# EAGLE schematic FPGA_pin_demo (EAGLE 5.10)

## Sheet 1 of 5
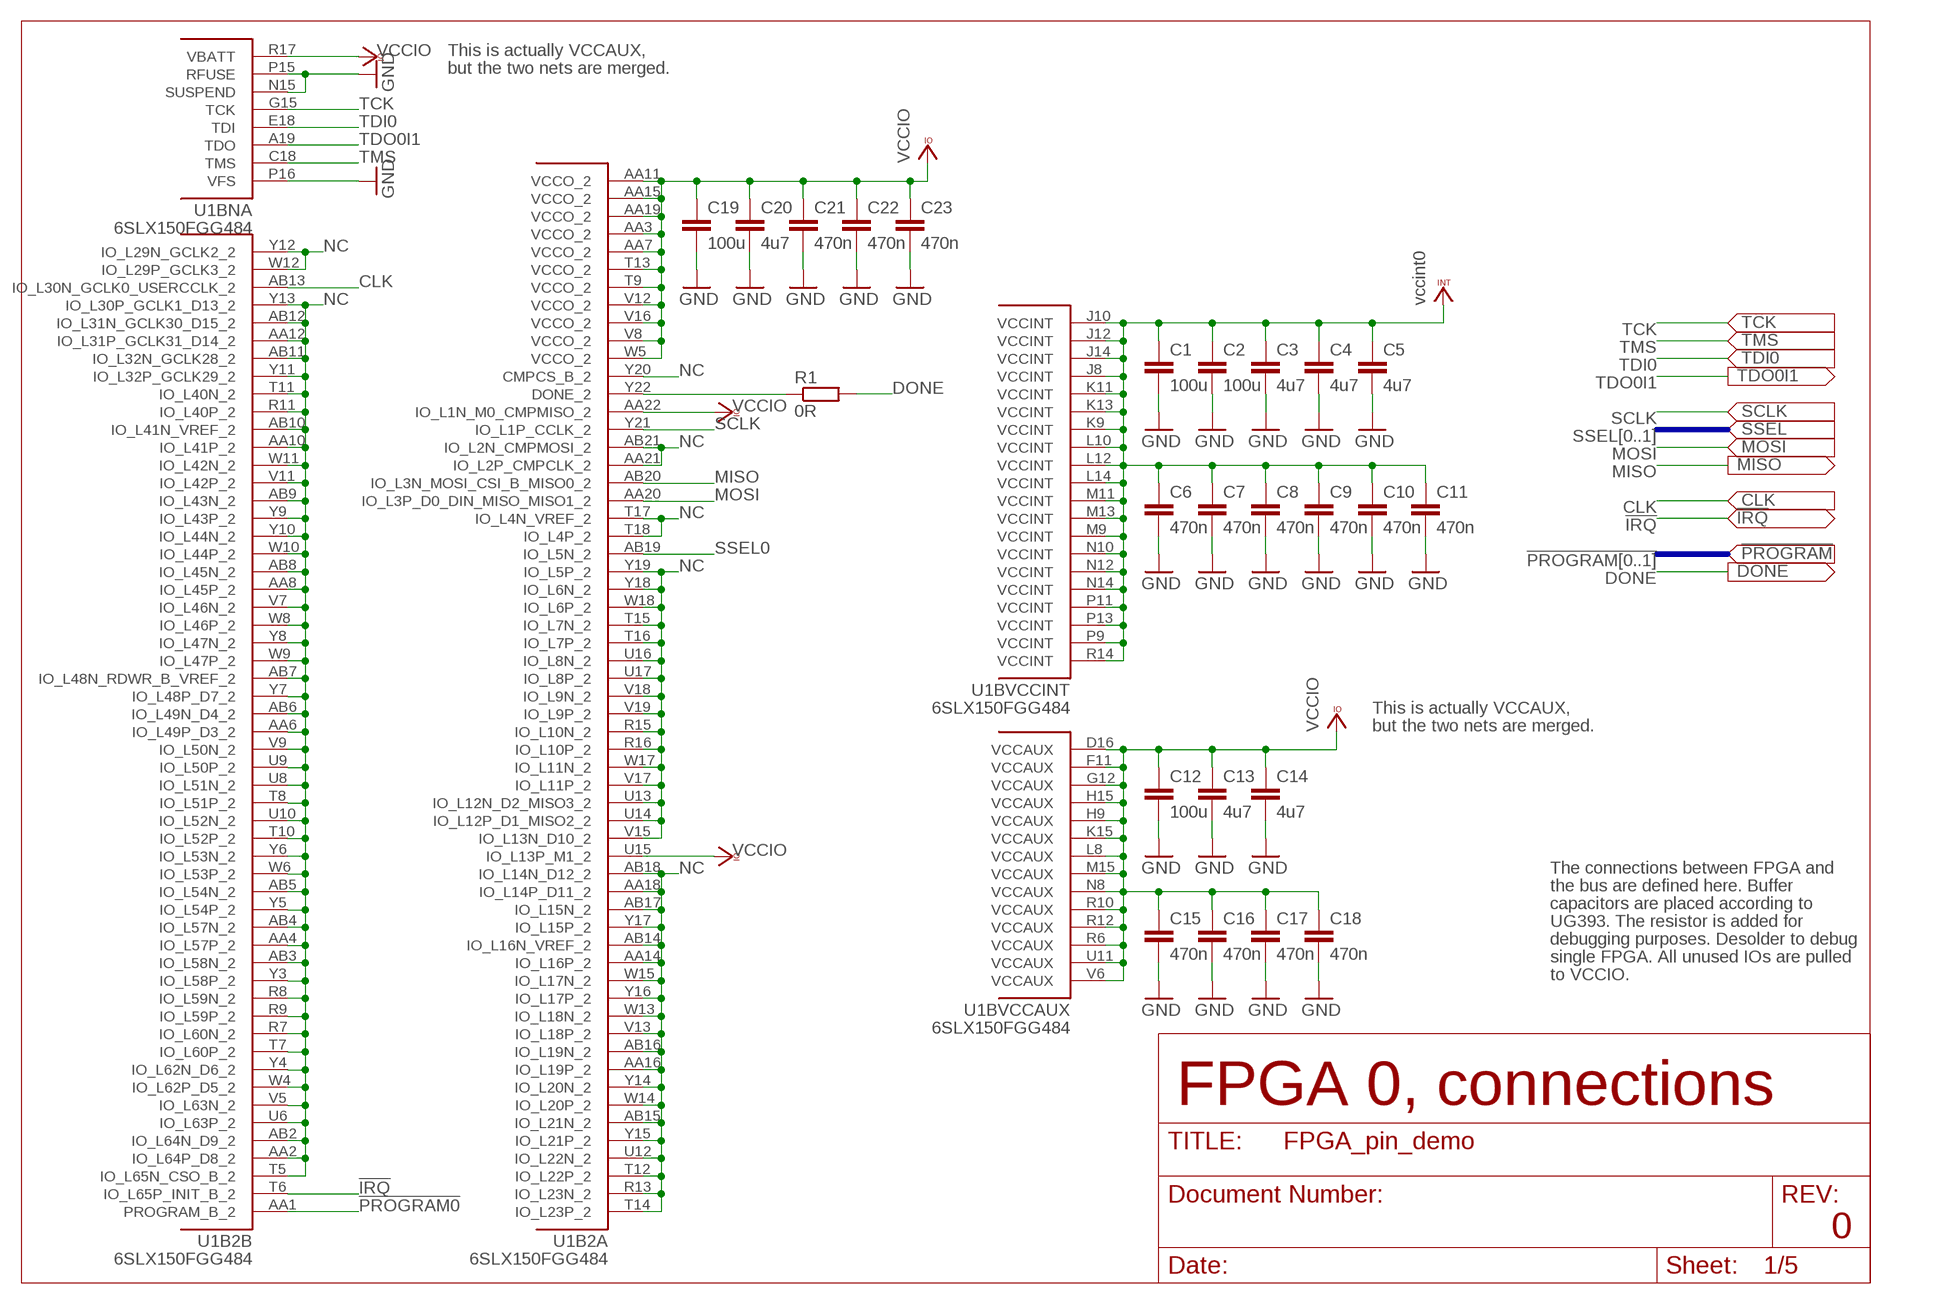
[diagram p0: schematic, sheet 1]

### Parts
C1  100u  C-EUC3225  [C3225]
C2  100u  C-EUC3225  [C3225]
C3  4u7  C-EUC2012  [C2012]
C4  4u7  C-EUC2012  [C2012]
C5  4u7  C-EUC2012  [C2012]
C6  470n  C-EUC1005  [C1005]
C7  470n  C-EUC1005  [C1005]
C8  470n  C-EUC1005  [C1005]
C9  470n  C-EUC1005  [C1005]
C10  470n  C-EUC1005  [C1005]
C11  470n  C-EUC1005  [C1005]
C12  100u  C-EUC3225  [C3225]
C13  4u7  C-EUC2012  [C2012]
C14  4u7  C-EUC2012  [C2012]
C15  470n  C-EUC1005  [C1005]
C16  470n  C-EUC1005  [C1005]
C17  470n  C-EUC1005  [C1005]
C18  470n  C-EUC1005  [C1005]
C19  100u  C-EUC3225  [C3225]
C20  4u7  C-EUC2012  [C2012]
C21  470n  C-EUC1005  [C1005]
C22  470n  C-EUC1005  [C1005]
C23  470n  C-EUC1005  [C1005]
R1  0R  R-EU_R2012  [R2012]
U1  6SLX150FGG484  [FG484]

### Nets
!IRQ: U1.T6(B2B:IO_L65P_INIT_B_2) ; also sheet 3,5
!PROGRAM0: U1.AA1(B2B:PROGRAM_B_2) ; also sheet 5
CLK: U1.AB13(B2B:IO_L30N_GCLK0_USERCCLK_2) ; also sheet 3,5
DONE: R1.2 ; also sheet 3,5
DONE_0: R1.1 U1.Y22(B2A:DONE_2)
GND: C1.2 C2.2 C3.2 C4.2 C5.2 C6.2 C7.2 C8.2 C9.2 C10.2 C11.2 C12.2 C13.2 C14.2 C15.2 C16.2 C17.2 C18.2 C19.2 C20.2 C21.2 C22.2 C23.2 U1.N15(BNA:SUSPEND) U1.P15(BNA:RFUSE) U1.P16(BNA:VFS) ; also sheet 2,3,4,5
MISO: U1.AB20(B2A:IO_L3N_MOSI_CSI_B_MISO0_2) ; also sheet 3,5
MOSI: U1.AA20(B2A:IO_L3P_D0_DIN_MISO_MISO1_2) ; also sheet 3,5
NC: U1.AA2(B2B:IO_L64P_D8_2) U1.AA4(B2B:IO_L57P_2) U1.AA6(B2B:IO_L49P_D3_2) U1.AA8(B2B:IO_L45P_2) U1.AA10(B2B:IO_L41P_2) U1.AA12(B2B:IO_L31P_GCLK31_D14_2) U1.AA14(B2A:IO_L16P_2) U1.AA16(B2A:IO_L19P_2) U1.AA18(B2A:IO_L14P_D11_2) U1.AA21(B2A:IO_L2P_CMPCLK_2) U1.AB2(B2B:IO_L64N_D9_2) U1.AB3(B2B:IO_L58N_2) U1.AB4(B2B:IO_L57N_2) U1.AB5(B2B:IO_L54N_2) U1.AB6(B2B:IO_L49N_D4_2) U1.AB7(B2B:IO_L48N_RDWR_B_VREF_2) U1.AB8(B2B:IO_L45N_2) U1.AB9(B2B:IO_L43N_2) U1.AB10(B2B:IO_L41N_VREF_2) U1.AB11(B2B:IO_L32N_GCLK28_2) U1.AB12(B2B:IO_L31N_GCLK30_D15_2) U1.AB14(B2A:IO_L16N_VREF_2) U1.AB15(B2A:IO_L21N_2) U1.AB16(B2A:IO_L19N_2) U1.AB17(B2A:IO_L15N_2) U1.AB18(B2A:IO_L14N_D12_2) U1.AB21(B2A:IO_L2N_CMPMOSI_2) U1.R7(B2B:IO_L60N_2) U1.R8(B2B:IO_L59N_2) U1.R9(B2B:IO_L59P_2) U1.R11(B2B:IO_L40P_2) U1.R13(B2A:IO_L23N_2) U1.R15(B2A:IO_L10N_2) U1.R16(B2A:IO_L10P_2) U1.T5(B2B:IO_L65N_CSO_B_2) U1.T7(B2B:IO_L60P_2) U1.T8(B2B:IO_L51P_2) U1.T10(B2B:IO_L52P_2) U1.T11(B2B:IO_L40N_2) U1.T12(B2A:IO_L22P_2) U1.T14(B2A:IO_L23P_2) U1.T15(B2A:IO_L7N_2) U1.T16(B2A:IO_L7P_2) U1.T17(B2A:IO_L4N_VREF_2) U1.T18(B2A:IO_L4P_2) U1.U6(B2B:IO_L63P_2) U1.U8(B2B:IO_L51N_2) U1.U9(B2B:IO_L50P_2) U1.U10(B2B:IO_L52N_2) U1.U12(B2A:IO_L22N_2) U1.U13(B2A:IO_L12N_D2_MISO3_2) U1.U14(B2A:IO_L12P_D1_MISO2_2) U1.U16(B2A:IO_L8N_2) U1.U17(B2A:IO_L8P_2) U1.V5(B2B:IO_L63N_2) U1.V7(B2B:IO_L46N_2) U1.V9(B2B:IO_L50N_2) U1.V11(B2B:IO_L42P_2) U1.V13(B2A:IO_L18P_2) U1.V15(B2A:IO_L13N_D10_2) U1.V17(B2A:IO_L11P_2) U1.V18(B2A:IO_L9N_2) U1.V19(B2A:IO_L9P_2) U1.W4(B2B:IO_L62P_D5_2) U1.W6(B2B:IO_L53P_2) U1.W8(B2B:IO_L46P_2) U1.W9(B2B:IO_L47P_2) U1.W10(B2B:IO_L44P_2) U1.W11(B2B:IO_L42N_2) U1.W12(B2B:IO_L29P_GCLK3_2) U1.W13(B2A:IO_L18N_2) U1.W14(B2A:IO_L20P_2) U1.W15(B2A:IO_L17N_2) U1.W17(B2A:IO_L11N_2) U1.W18(B2A:IO_L6P_2) U1.Y3(B2B:IO_L58P_2) U1.Y4(B2B:IO_L62N_D6_2) U1.Y5(B2B:IO_L54P_2) U1.Y6(B2B:IO_L53N_2) U1.Y7(B2B:IO_L48P_D7_2) U1.Y8(B2B:IO_L47N_2) U1.Y9(B2B:IO_L43P_2) U1.Y10(B2B:IO_L44N_2) U1.Y11(B2B:IO_L32P_GCLK29_2) U1.Y12(B2B:IO_L29N_GCLK2_2) U1.Y13(B2B:IO_L30P_GCLK1_D13_2) U1.Y14(B2A:IO_L20N_2) U1.Y15(B2A:IO_L21P_2) U1.Y16(B2A:IO_L17P_2) U1.Y17(B2A:IO_L15P_2) U1.Y18(B2A:IO_L6N_2) U1.Y19(B2A:IO_L5P_2) U1.Y20(B2A:CMPCS_B_2) ; also sheet 2,3,4,5
SCLK: U1.Y21(B2A:IO_L1P_CCLK_2) ; also sheet 3,5
SSEL0: U1.AB19(B2A:IO_L5N_2) ; also sheet 5
TCK: U1.G15(BNA:TCK) ; also sheet 3,5
TDI0: U1.E18(BNA:TDI) ; also sheet 5
TDO0I1: U1.A19(BNA:TDO) ; also sheet 3
TMS: U1.C18(BNA:TMS) ; also sheet 3,5
VCCINT0: C1.1 C2.1 C3.1 C4.1 C5.1 C6.1 C7.1 C8.1 C9.1 C10.1 C11.1 U1.J8(BVCCINT:VCCINT) U1.J10(BVCCINT:VCCINT) U1.J12(BVCCINT:VCCINT) U1.J14(BVCCINT:VCCINT) U1.K9(BVCCINT:VCCINT) U1.K11(BVCCINT:VCCINT) U1.K13(BVCCINT:VCCINT) U1.L10(BVCCINT:VCCINT) U1.L12(BVCCINT:VCCINT) U1.L14(BVCCINT:VCCINT) U1.M9(BVCCINT:VCCINT) U1.M11(BVCCINT:VCCINT) U1.M13(BVCCINT:VCCINT) U1.N10(BVCCINT:VCCINT) U1.N12(BVCCINT:VCCINT) U1.N14(BVCCINT:VCCINT) U1.P9(BVCCINT:VCCINT) U1.P11(BVCCINT:VCCINT) U1.P13(BVCCINT:VCCINT) U1.R14(BVCCINT:VCCINT) ; supply symbol labelled vccint0 ; also sheet 5
VCCIO: C12.1 C13.1 C14.1 C15.1 C16.1 C17.1 C18.1 C19.1 C20.1 C21.1 C22.1 C23.1 U1.AA3(B2A:VCCO_2) U1.AA7(B2A:VCCO_2) U1.AA11(B2A:VCCO_2) U1.AA15(B2A:VCCO_2) U1.AA19(B2A:VCCO_2) U1.AA22(B2A:IO_L1N_M0_CMPMISO_2) U1.D16(BVCCAUX:VCCAUX) U1.F11(BVCCAUX:VCCAUX) U1.G12(BVCCAUX:VCCAUX) U1.H9(BVCCAUX:VCCAUX) U1.H15(BVCCAUX:VCCAUX) U1.K15(BVCCAUX:VCCAUX) U1.L8(BVCCAUX:VCCAUX) U1.M15(BVCCAUX:VCCAUX) U1.N8(BVCCAUX:VCCAUX) U1.R6(BVCCAUX:VCCAUX) U1.R10(BVCCAUX:VCCAUX) U1.R12(BVCCAUX:VCCAUX) U1.R17(BNA:VBATT) U1.T9(B2A:VCCO_2) U1.T13(B2A:VCCO_2) U1.U11(BVCCAUX:VCCAUX) U1.U15(B2A:IO_L13P_M1_2) U1.V6(BVCCAUX:VCCAUX) U1.V8(B2A:VCCO_2) U1.V12(B2A:VCCO_2) U1.V16(B2A:VCCO_2) U1.W5(B2A:VCCO_2) ; also sheet 2,3,4,5

### Buses
SSEL[0..1]
!PROGRAM[0..1]

### Notes on the sheet
- This is actually VCCAUX,
- but the two nets are merged.
- This is actually VCCAUX,
- but the two nets are merged.
- The connections between FPGA and
- the bus are defined here. Buffer
- capacitors are placed according to
- UG393. The resistor is added for
- debugging purposes. Desolder to debug
- single FPGA. All unused IOs are pulled
- to VCCIO.
- FPGA 0, connections
- 0

## Sheet 2 of 5
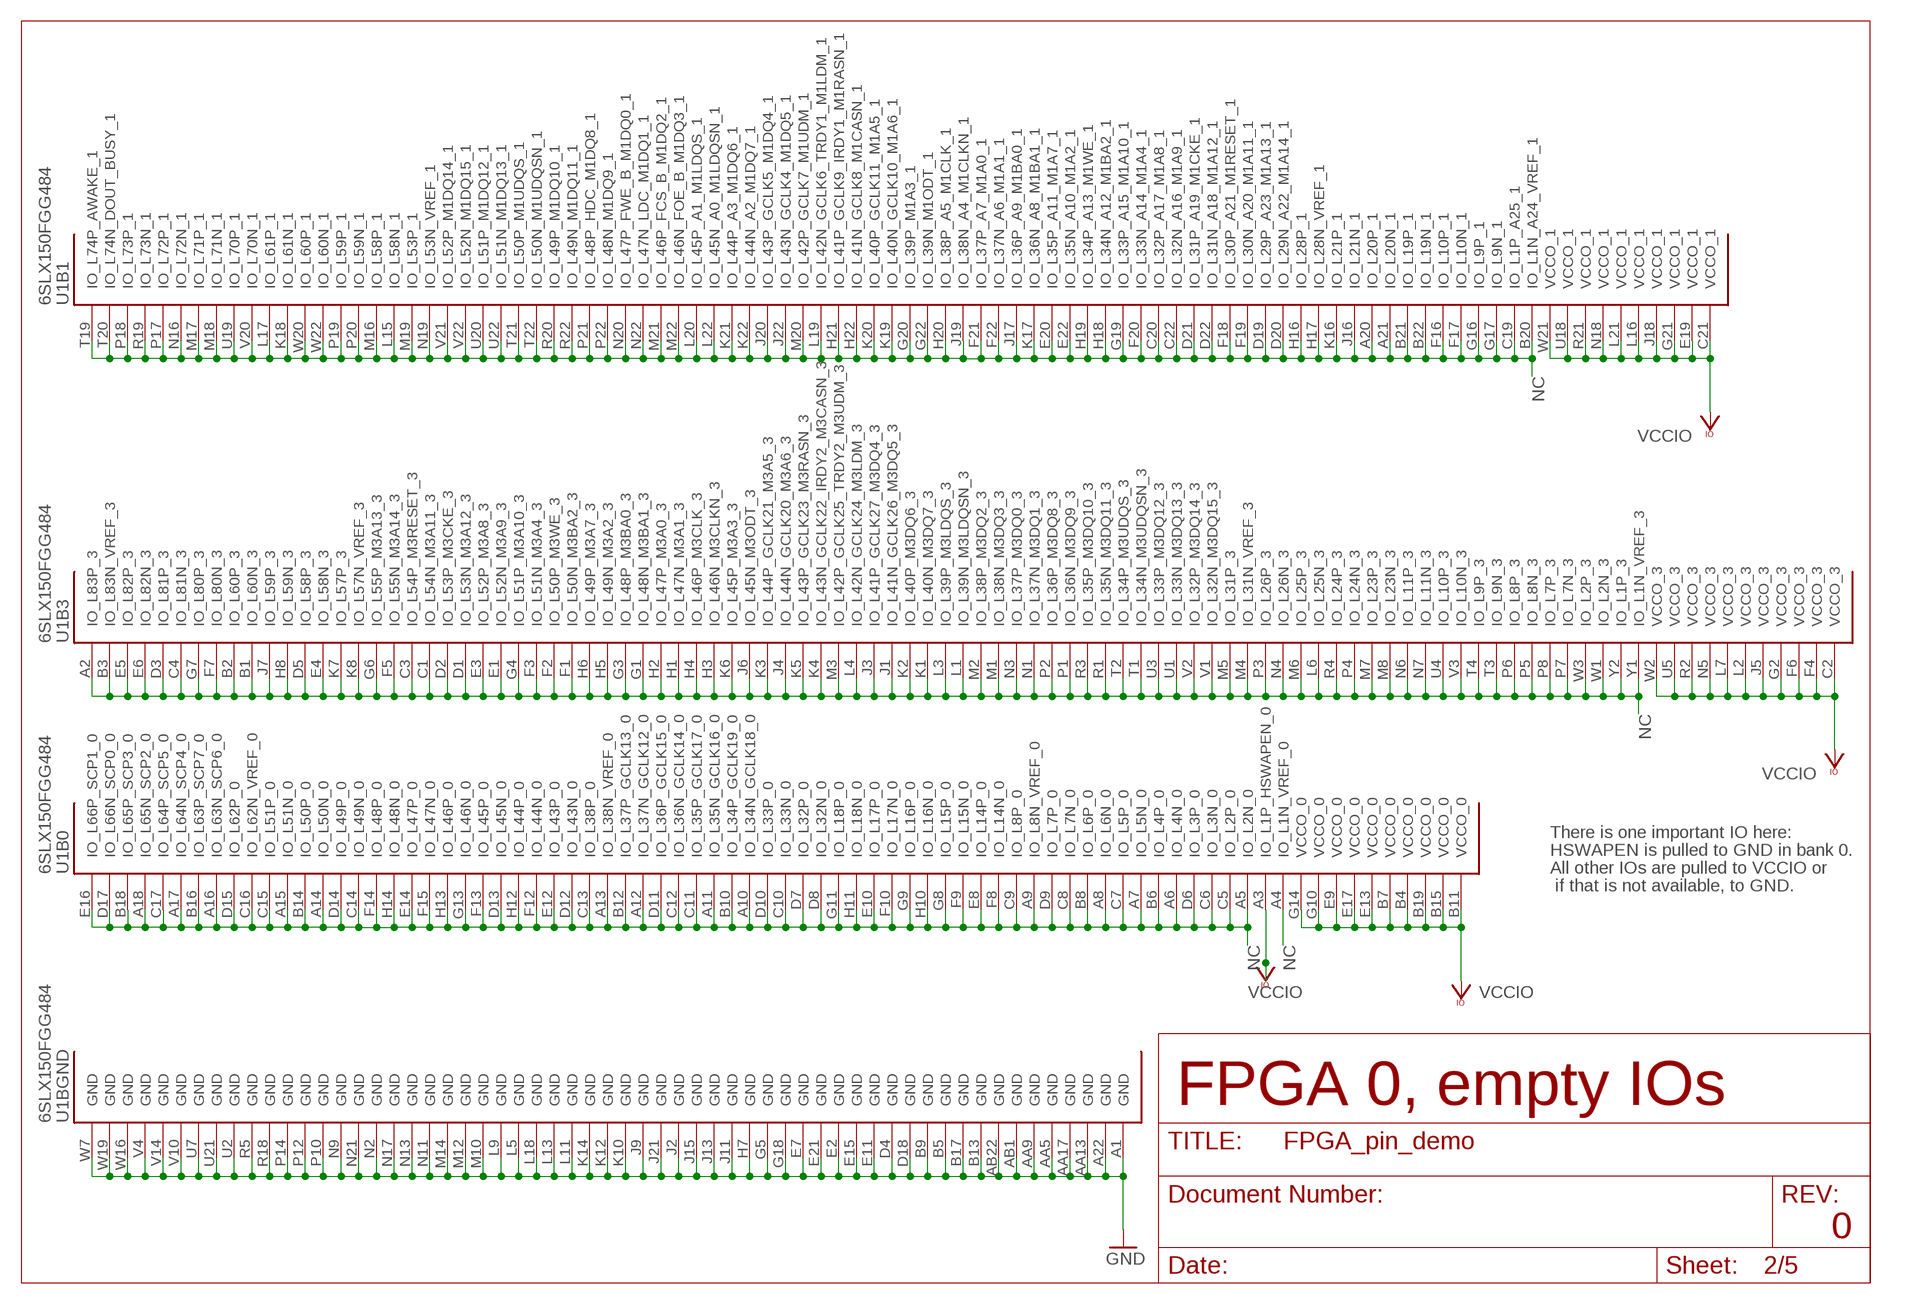
[diagram p1: schematic, sheet 2]

### Nets
GND: U1.A1(BGND:GND) U1.A22(BGND:GND) U1.AA5(BGND:GND) U1.AA9(BGND:GND) U1.AA13(BGND:GND) U1.AA17(BGND:GND) U1.AB1(BGND:GND) U1.AB22(BGND:GND) U1.B5(BGND:GND) U1.B9(BGND:GND) U1.B13(BGND:GND) U1.B17(BGND:GND) U1.D4(BGND:GND) U1.D18(BGND:GND) U1.E2(BGND:GND) U1.E7(BGND:GND) U1.E11(BGND:GND) U1.E15(BGND:GND) U1.E21(BGND:GND) U1.G5(BGND:GND) U1.G18(BGND:GND) U1.H7(BGND:GND) U1.J2(BGND:GND) U1.J9(BGND:GND) U1.J11(BGND:GND) U1.J13(BGND:GND) U1.J15(BGND:GND) U1.J21(BGND:GND) U1.K10(BGND:GND) U1.K12(BGND:GND) U1.K14(BGND:GND) U1.L5(BGND:GND) U1.L9(BGND:GND) U1.L11(BGND:GND) U1.L13(BGND:GND) U1.L18(BGND:GND) U1.M10(BGND:GND) U1.M12(BGND:GND) U1.M14(BGND:GND) U1.N2(BGND:GND) U1.N9(BGND:GND) U1.N11(BGND:GND) U1.N13(BGND:GND) U1.N17(BGND:GND) U1.N21(BGND:GND) U1.P10(BGND:GND) U1.P12(BGND:GND) U1.P14(BGND:GND) U1.R5(BGND:GND) U1.R18(BGND:GND) U1.U2(BGND:GND) U1.U7(BGND:GND) U1.U21(BGND:GND) U1.V4(BGND:GND) U1.V10(BGND:GND) U1.V14(BGND:GND) U1.W7(BGND:GND) U1.W16(BGND:GND) U1.W19(BGND:GND) ; also sheet 1,3,4,5
NC: U1.A2(B3:IO_L83P_3) U1.A4(B0:IO_L1N_VREF_0) U1.A5(B0:IO_L2N_0) U1.A6(B0:IO_L4N_0) U1.A7(B0:IO_L5N_0) U1.A8(B0:IO_L6N_0) U1.A9(B0:IO_L8N_VREF_0) U1.A10(B0:IO_L34N_GCLK18_0) U1.A11(B0:IO_L35N_GCLK16_0) U1.A12(B0:IO_L37N_GCLK12_0) U1.A13(B0:IO_L38N_VREF_0) U1.A14(B0:IO_L50N_0) U1.A15(B0:IO_L51N_0) U1.A16(B0:IO_L63N_SCP6_0) U1.A17(B0:IO_L64N_SCP4_0) U1.A18(B0:IO_L65N_SCP2_0) U1.A20(B1:IO_L20P_1) U1.A21(B1:IO_L20N_1) U1.B1(B3:IO_L60N_3) U1.B2(B3:IO_L60P_3) U1.B3(B3:IO_L83N_VREF_3) U1.B6(B0:IO_L4P_0) U1.B8(B0:IO_L6P_0) U1.B10(B0:IO_L34P_GCLK19_0) U1.B12(B0:IO_L37P_GCLK13_0) U1.B14(B0:IO_L50P_0) U1.B16(B0:IO_L63P_SCP7_0) U1.B18(B0:IO_L65P_SCP3_0) U1.B20(B1:IO_L1N_A24_VREF_1) U1.B21(B1:IO_L19P_1) U1.B22(B1:IO_L19N_1) U1.C1(B3:IO_L54N_M3A11_3) U1.C3(B3:IO_L54P_M3RESET_3) U1.C4(B3:IO_L81N_3) U1.C5(B0:IO_L2P_0) U1.C6(B0:IO_L3N_0) U1.C7(B0:IO_L5P_0) U1.C8(B0:IO_L7N_0) U1.C9(B0:IO_L8P_0) U1.C10(B0:IO_L33N_0) U1.C11(B0:IO_L35P_GCLK17_0) U1.C12(B0:IO_L36N_GCLK14_0) U1.C13(B0:IO_L38P_0) U1.C14(B0:IO_L49N_0) U1.C15(B0:IO_L51P_0) U1.C16(B0:IO_L62N_VREF_0) U1.C17(B0:IO_L64P_SCP5_0) U1.C19(B1:IO_L1P_A25_1) U1.C20(B1:IO_L32P_A17_M1A8_1) U1.C22(B1:IO_L32N_A16_M1A9_1) U1.D1(B3:IO_L53N_M3A12_3) U1.D2(B3:IO_L53P_M3CKE_3) U1.D3(B3:IO_L81P_3) U1.D5(B3:IO_L58P_3) U1.D6(B0:IO_L3P_0) U1.D7(B0:IO_L32P_0) U1.D8(B0:IO_L32N_0) U1.D9(B0:IO_L7P_0) U1.D10(B0:IO_L33P_0) U1.D11(B0:IO_L36P_GCLK15_0) U1.D12(B0:IO_L43N_0) U1.D13(B0:IO_L45N_0) U1.D14(B0:IO_L49P_0) U1.D15(B0:IO_L62P_0) U1.D17(B0:IO_L66N_SCP0_0) U1.D19(B1:IO_L29P_A23_M1A13_1) U1.D20(B1:IO_L29N_A22_M1A14_1) U1.D21(B1:IO_L31P_A19_M1CKE_1) U1.D22(B1:IO_L31N_A18_M1A12_1) U1.E1(B3:IO_L52N_M3A9_3) U1.E3(B3:IO_L52P_M3A8_3) U1.E4(B3:IO_L58N_3) U1.E5(B3:IO_L82P_3) U1.E6(B3:IO_L82N_3) U1.E8(B0:IO_L14P_0) U1.E10(B0:IO_L17P_0) U1.E12(B0:IO_L43P_0) U1.E14(B0:IO_L47P_0) U1.E16(B0:IO_L66P_SCP1_0) U1.E20(B1:IO_L35P_A11_M1A7_1) U1.E22(B1:IO_L35N_A10_M1A2_1) U1.F1(B3:IO_L50N_M3BA2_3) U1.F2(B3:IO_L50P_M3WE_3) U1.F3(B3:IO_L51N_M3A4_3) U1.F5(B3:IO_L55N_M3A14_3) U1.F7(B3:IO_L80N_3) U1.F8(B0:IO_L14N_0) U1.F9(B0:IO_L15N_0) U1.F10(B0:IO_L17N_0) U1.F12(B0:IO_L44N_0) U1.F13(B0:IO_L45P_0) U1.F14(B0:IO_L48P_0) U1.F15(B0:IO_L47N_0) U1.F16(B1:IO_L10P_1) U1.F17(B1:IO_L10N_1) U1.F18(B1:IO_L30P_A21_M1RESET_1) U1.F19(B1:IO_L30N_A20_M1A11_1) U1.F20(B1:IO_L33N_A14_M1A4_1) U1.F21(B1:IO_L37P_A7_M1A0_1) U1.F22(B1:IO_L37N_A6_M1A1_1) U1.G1(B3:IO_L48N_M3BA1_3) U1.G3(B3:IO_L48P_M3BA0_3) U1.G4(B3:IO_L51P_M3A10_3) U1.G6(B3:IO_L55P_M3A13_3) U1.G7(B3:IO_L80P_3) U1.G8(B0:IO_L15P_0) U1.G9(B0:IO_L16P_0) U1.G11(B0:IO_L18P_0) U1.G13(B0:IO_L46N_0) U1.G16(B1:IO_L9P_1) U1.G17(B1:IO_L9N_1) U1.G19(B1:IO_L33P_A15_M1A10_1) U1.G20(B1:IO_L39P_M1A3_1) U1.G22(B1:IO_L39N_M1ODT_1) U1.H1(B3:IO_L47N_M3A1_3) U1.H2(B3:IO_L47P_M3A0_3) U1.H3(B3:IO_L46N_M3CLKN_3) U1.H4(B3:IO_L46P_M3CLK_3) U1.H5(B3:IO_L49N_M3A2_3) U1.H6(B3:IO_L49P_M3A7_3) U1.H8(B3:IO_L59N_3) U1.H10(B0:IO_L16N_0) U1.H11(B0:IO_L18N_0) U1.H12(B0:IO_L44P_0) U1.H13(B0:IO_L46P_0) U1.H14(B0:IO_L48N_0) U1.H16(B1:IO_L28P_1) U1.H17(B1:IO_L28N_VREF_1) U1.H18(B1:IO_L34N_A12_M1BA2_1) U1.H19(B1:IO_L34P_A13_M1WE_1) U1.H20(B1:IO_L38P_A5_M1CLK_1) U1.H21(B1:IO_L41P_GCLK9_IRDY1_M1RASN_1) U1.H22(B1:IO_L41N_GCLK8_M1CASN_1) U1.J1(B3:IO_L41N_GCLK26_M3DQ5_3) U1.J3(B3:IO_L41P_GCLK27_M3DQ4_3) U1.J4(B3:IO_L44N_GCLK20_M3A6_3) U1.J6(B3:IO_L45N_M3ODT_3) U1.J7(B3:IO_L59P_3) U1.J16(B1:IO_L21N_1) U1.J17(B1:IO_L36P_A9_M1BA0_1) U1.J19(B1:IO_L38N_A4_M1CLKN_1) U1.J20(B1:IO_L43P_GCLK5_M1DQ4_1) U1.J22(B1:IO_L43N_GCLK4_M1DQ5_1) U1.K1(B3:IO_L40N_M3DQ7_3) U1.K2(B3:IO_L40P_M3DQ6_3) U1.K3(B3:IO_L44P_GCLK21_M3A5_3) U1.K4(B3:IO_L43N_GCLK22_IRDY2_M3CASN_3) U1.K5(B3:IO_L43P_GCLK23_M3RASN_3) U1.K6(B3:IO_L45P_M3A3_3) U1.K7(B3:IO_L57P_3) U1.K8(B3:IO_L57N_VREF_3) U1.K16(B1:IO_L21P_1) U1.K17(B1:IO_L36N_A8_M1BA1_1) U1.K18(B1:IO_L61N_1) U1.K19(B1:IO_L40N_GCLK10_M1A6_1) U1.K20(B1:IO_L40P_GCLK11_M1A5_1) U1.K21(B1:IO_L44P_A3_M1DQ6_1) U1.K22(B1:IO_L44N_A2_M1DQ7_1) U1.L1(B3:IO_L39N_M3LDQSN_3) U1.L3(B3:IO_L39P_M3LDQS_3) U1.L4(B3:IO_L42N_GCLK24_M3LDM_3) U1.L6(B3:IO_L25N_3) U1.L15(B1:IO_L58N_1) U1.L17(B1:IO_L61P_1) U1.L19(B1:IO_L42N_GCLK6_TRDY1_M1LDM_1) U1.L20(B1:IO_L45P_A1_M1LDQS_1) U1.L22(B1:IO_L45N_A0_M1LDQSN_1) U1.M1(B3:IO_L38N_M3DQ3_3) U1.M2(B3:IO_L38P_M3DQ2_3) U1.M3(B3:IO_L42P_GCLK25_TRDY2_M3UDM_3) U1.M4(B3:IO_L31N_VREF_3) U1.M5(B3:IO_L31P_3) U1.M6(B3:IO_L25P_3) U1.M7(B3:IO_L23P_3) U1.M8(B3:IO_L23N_3) U1.M16(B1:IO_L58P_1) U1.M17(B1:IO_L71P_1) U1.M18(B1:IO_L71N_1) U1.M19(B1:IO_L53P_1) U1.M20(B1:IO_L42P_GCLK7_M1UDM_1) U1.M21(B1:IO_L46P_FCS_B_M1DQ2_1) U1.M22(B1:IO_L46N_FOE_B_M1DQ3_1) U1.N1(B3:IO_L37N_M3DQ1_3) U1.N3(B3:IO_L37P_M3DQ0_3) U1.N4(B3:IO_L26N_3) U1.N6(B3:IO_L11P_3) U1.N7(B3:IO_L11N_3) U1.N16(B1:IO_L72N_1) U1.N19(B1:IO_L53N_VREF_1) U1.N20(B1:IO_L47P_FWE_B_M1DQ0_1) U1.N22(B1:IO_L47N_LDC_M1DQ1_1) U1.P1(B3:IO_L36N_M3DQ9_3) U1.P2(B3:IO_L36P_M3DQ8_3) U1.P3(B3:IO_L26P_3) U1.P4(B3:IO_L24N_3) U1.P5(B3:IO_L8N_3) U1.P6(B3:IO_L8P_3) U1.P7(B3:IO_L7N_3) U1.P8(B3:IO_L7P_3) U1.P17(B1:IO_L72P_1) U1.P18(B1:IO_L73P_1) U1.P19(B1:IO_L59P_1) U1.P20(B1:IO_L59N_1) U1.P21(B1:IO_L48P_HDC_M1DQ8_1) U1.P22(B1:IO_L48N_M1DQ9_1) U1.R1(B3:IO_L35N_M3DQ11_3) U1.R3(B3:IO_L35P_M3DQ10_3) U1.R4(B3:IO_L24P_3) U1.R19(B1:IO_L73N_1) U1.R20(B1:IO_L49P_M1DQ10_1) U1.R22(B1:IO_L49N_M1DQ11_1) U1.T1(B3:IO_L34N_M3UDQSN_3) U1.T2(B3:IO_L34P_M3UDQS_3) U1.T3(B3:IO_L9N_3) U1.T4(B3:IO_L9P_3) U1.T19(B1:IO_L74P_AWAKE_1) U1.T20(B1:IO_L74N_DOUT_BUSY_1) U1.T21(B1:IO_L50P_M1UDQS_1) U1.T22(B1:IO_L50N_M1UDQSN_1) U1.U1(B3:IO_L33N_M3DQ13_3) U1.U3(B3:IO_L33P_M3DQ12_3) U1.U4(B3:IO_L10P_3) U1.U19(B1:IO_L70P_1) U1.U20(B1:IO_L51P_M1DQ12_1) U1.U22(B1:IO_L51N_M1DQ13_1) U1.V1(B3:IO_L32N_M3DQ15_3) U1.V2(B3:IO_L32P_M3DQ14_3) U1.V3(B3:IO_L10N_3) U1.V20(B1:IO_L70N_1) U1.V21(B1:IO_L52P_M1DQ14_1) U1.V22(B1:IO_L52N_M1DQ15_1) U1.W1(B3:IO_L2N_3) U1.W3(B3:IO_L2P_3) U1.W20(B1:IO_L60P_1) U1.W22(B1:IO_L60N_1) U1.Y1(B3:IO_L1N_VREF_3) U1.Y2(B3:IO_L1P_3) ; also sheet 1,3,4,5
VCCIO: U1.A3(B0:IO_L1P_HSWAPEN_0) U1.B4(B0:VCCO_0) U1.B7(B0:VCCO_0) U1.B11(B0:VCCO_0) U1.B15(B0:VCCO_0) U1.B19(B0:VCCO_0) U1.C2(B3:VCCO_3) U1.C21(B1:VCCO_1) U1.E9(B0:VCCO_0) U1.E13(B0:VCCO_0) U1.E17(B0:VCCO_0) U1.E19(B1:VCCO_1) U1.F4(B3:VCCO_3) U1.F6(B3:VCCO_3) U1.G2(B3:VCCO_3) U1.G10(B0:VCCO_0) U1.G14(B0:VCCO_0) U1.G21(B1:VCCO_1) U1.J5(B3:VCCO_3) U1.J18(B1:VCCO_1) U1.L2(B3:VCCO_3) U1.L7(B3:VCCO_3) U1.L16(B1:VCCO_1) U1.L21(B1:VCCO_1) U1.N5(B3:VCCO_3) U1.N18(B1:VCCO_1) U1.R2(B3:VCCO_3) U1.R21(B1:VCCO_1) U1.U5(B3:VCCO_3) U1.U18(B1:VCCO_1) U1.W2(B3:VCCO_3) U1.W21(B1:VCCO_1) ; also sheet 1,3,4,5

### Notes on the sheet
- There is one important IO here:
- HSWAPEN is pulled to GND in bank 0.
- All other IOs are pulled to VCCIO or
- if that is not available, to GND.
- FPGA 0, empty IOs
- 0

## Sheet 3 of 5
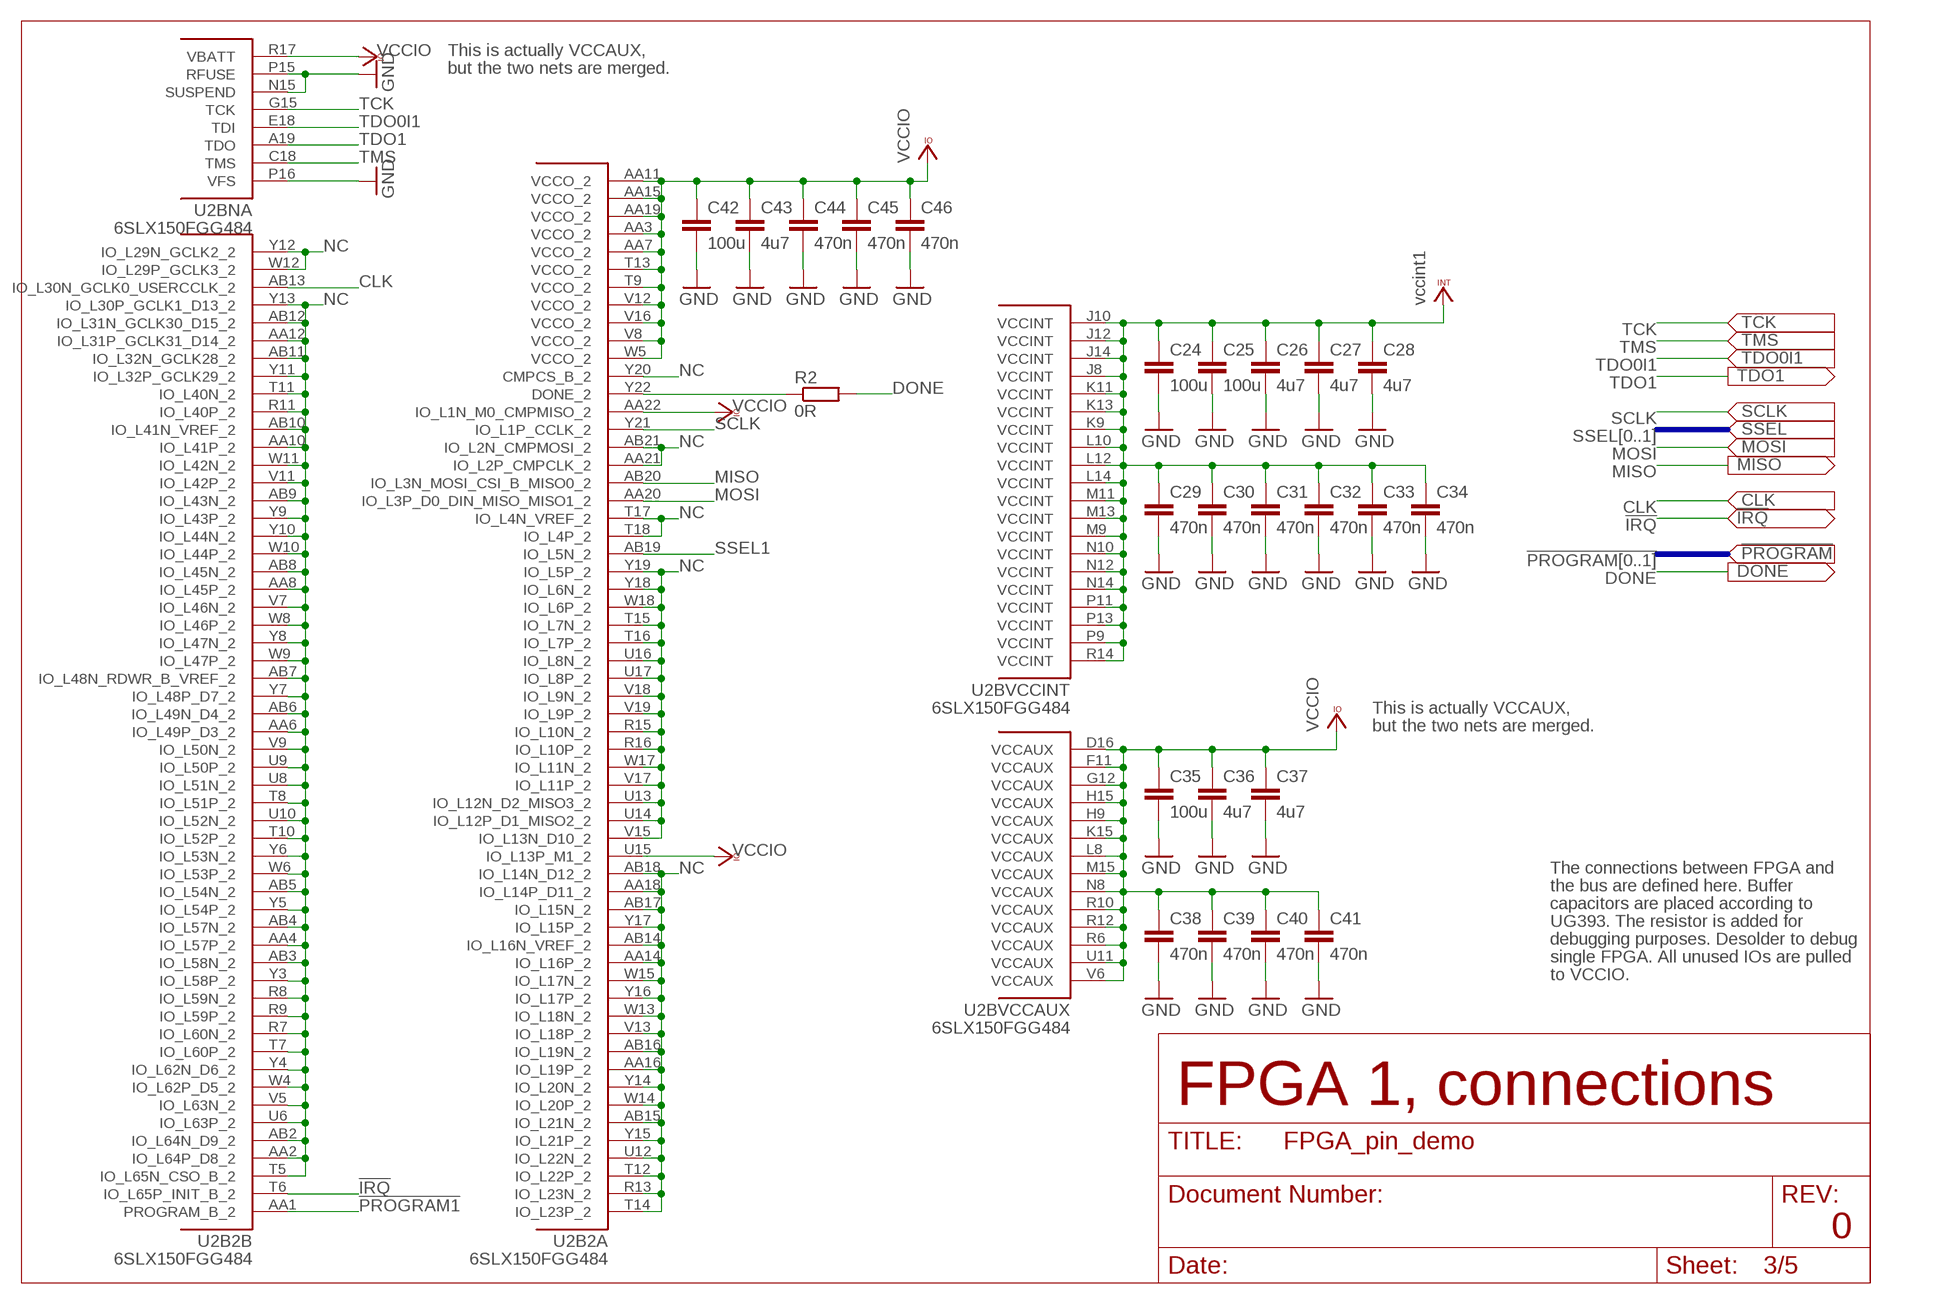
[diagram p2: schematic, sheet 3]

### Parts
C24  100u  C-EUC3225  [C3225]
C25  100u  C-EUC3225  [C3225]
C26  4u7  C-EUC2012  [C2012]
C27  4u7  C-EUC2012  [C2012]
C28  4u7  C-EUC2012  [C2012]
C29  470n  C-EUC1005  [C1005]
C30  470n  C-EUC1005  [C1005]
C31  470n  C-EUC1005  [C1005]
C32  470n  C-EUC1005  [C1005]
C33  470n  C-EUC1005  [C1005]
C34  470n  C-EUC1005  [C1005]
C35  100u  C-EUC3225  [C3225]
C36  4u7  C-EUC2012  [C2012]
C37  4u7  C-EUC2012  [C2012]
C38  470n  C-EUC1005  [C1005]
C39  470n  C-EUC1005  [C1005]
C40  470n  C-EUC1005  [C1005]
C41  470n  C-EUC1005  [C1005]
C42  100u  C-EUC3225  [C3225]
C43  4u7  C-EUC2012  [C2012]
C44  470n  C-EUC1005  [C1005]
C45  470n  C-EUC1005  [C1005]
C46  470n  C-EUC1005  [C1005]
R2  0R  R-EU_R2012  [R2012]
U2  6SLX150FGG484  [FG484]

### Nets
!IRQ: U2.T6(B2B:IO_L65P_INIT_B_2) ; also sheet 1,5
!PROGRAM1: U2.AA1(B2B:PROGRAM_B_2) ; also sheet 5
CLK: U2.AB13(B2B:IO_L30N_GCLK0_USERCCLK_2) ; also sheet 1,5
DONE: R2.2 ; also sheet 1,5
DONE_1: R2.1 U2.Y22(B2A:DONE_2)
GND: C24.2 C25.2 C26.2 C27.2 C28.2 C29.2 C30.2 C31.2 C32.2 C33.2 C34.2 C35.2 C36.2 C37.2 C38.2 C39.2 C40.2 C41.2 C42.2 C43.2 C44.2 C45.2 C46.2 U2.N15(BNA:SUSPEND) U2.P15(BNA:RFUSE) U2.P16(BNA:VFS) ; also sheet 1,2,4,5
MISO: U2.AB20(B2A:IO_L3N_MOSI_CSI_B_MISO0_2) ; also sheet 1,5
MOSI: U2.AA20(B2A:IO_L3P_D0_DIN_MISO_MISO1_2) ; also sheet 1,5
NC: U2.AA2(B2B:IO_L64P_D8_2) U2.AA4(B2B:IO_L57P_2) U2.AA6(B2B:IO_L49P_D3_2) U2.AA8(B2B:IO_L45P_2) U2.AA10(B2B:IO_L41P_2) U2.AA12(B2B:IO_L31P_GCLK31_D14_2) U2.AA14(B2A:IO_L16P_2) U2.AA16(B2A:IO_L19P_2) U2.AA18(B2A:IO_L14P_D11_2) U2.AA21(B2A:IO_L2P_CMPCLK_2) U2.AB2(B2B:IO_L64N_D9_2) U2.AB3(B2B:IO_L58N_2) U2.AB4(B2B:IO_L57N_2) U2.AB5(B2B:IO_L54N_2) U2.AB6(B2B:IO_L49N_D4_2) U2.AB7(B2B:IO_L48N_RDWR_B_VREF_2) U2.AB8(B2B:IO_L45N_2) U2.AB9(B2B:IO_L43N_2) U2.AB10(B2B:IO_L41N_VREF_2) U2.AB11(B2B:IO_L32N_GCLK28_2) U2.AB12(B2B:IO_L31N_GCLK30_D15_2) U2.AB14(B2A:IO_L16N_VREF_2) U2.AB15(B2A:IO_L21N_2) U2.AB16(B2A:IO_L19N_2) U2.AB17(B2A:IO_L15N_2) U2.AB18(B2A:IO_L14N_D12_2) U2.AB21(B2A:IO_L2N_CMPMOSI_2) U2.R7(B2B:IO_L60N_2) U2.R8(B2B:IO_L59N_2) U2.R9(B2B:IO_L59P_2) U2.R11(B2B:IO_L40P_2) U2.R13(B2A:IO_L23N_2) U2.R15(B2A:IO_L10N_2) U2.R16(B2A:IO_L10P_2) U2.T5(B2B:IO_L65N_CSO_B_2) U2.T7(B2B:IO_L60P_2) U2.T8(B2B:IO_L51P_2) U2.T10(B2B:IO_L52P_2) U2.T11(B2B:IO_L40N_2) U2.T12(B2A:IO_L22P_2) U2.T14(B2A:IO_L23P_2) U2.T15(B2A:IO_L7N_2) U2.T16(B2A:IO_L7P_2) U2.T17(B2A:IO_L4N_VREF_2) U2.T18(B2A:IO_L4P_2) U2.U6(B2B:IO_L63P_2) U2.U8(B2B:IO_L51N_2) U2.U9(B2B:IO_L50P_2) U2.U10(B2B:IO_L52N_2) U2.U12(B2A:IO_L22N_2) U2.U13(B2A:IO_L12N_D2_MISO3_2) U2.U14(B2A:IO_L12P_D1_MISO2_2) U2.U16(B2A:IO_L8N_2) U2.U17(B2A:IO_L8P_2) U2.V5(B2B:IO_L63N_2) U2.V7(B2B:IO_L46N_2) U2.V9(B2B:IO_L50N_2) U2.V11(B2B:IO_L42P_2) U2.V13(B2A:IO_L18P_2) U2.V15(B2A:IO_L13N_D10_2) U2.V17(B2A:IO_L11P_2) U2.V18(B2A:IO_L9N_2) U2.V19(B2A:IO_L9P_2) U2.W4(B2B:IO_L62P_D5_2) U2.W6(B2B:IO_L53P_2) U2.W8(B2B:IO_L46P_2) U2.W9(B2B:IO_L47P_2) U2.W10(B2B:IO_L44P_2) U2.W11(B2B:IO_L42N_2) U2.W12(B2B:IO_L29P_GCLK3_2) U2.W13(B2A:IO_L18N_2) U2.W14(B2A:IO_L20P_2) U2.W15(B2A:IO_L17N_2) U2.W17(B2A:IO_L11N_2) U2.W18(B2A:IO_L6P_2) U2.Y3(B2B:IO_L58P_2) U2.Y4(B2B:IO_L62N_D6_2) U2.Y5(B2B:IO_L54P_2) U2.Y6(B2B:IO_L53N_2) U2.Y7(B2B:IO_L48P_D7_2) U2.Y8(B2B:IO_L47N_2) U2.Y9(B2B:IO_L43P_2) U2.Y10(B2B:IO_L44N_2) U2.Y11(B2B:IO_L32P_GCLK29_2) U2.Y12(B2B:IO_L29N_GCLK2_2) U2.Y13(B2B:IO_L30P_GCLK1_D13_2) U2.Y14(B2A:IO_L20N_2) U2.Y15(B2A:IO_L21P_2) U2.Y16(B2A:IO_L17P_2) U2.Y17(B2A:IO_L15P_2) U2.Y18(B2A:IO_L6N_2) U2.Y19(B2A:IO_L5P_2) U2.Y20(B2A:CMPCS_B_2) ; also sheet 1,2,4,5
SCLK: U2.Y21(B2A:IO_L1P_CCLK_2) ; also sheet 1,5
SSEL1: U2.AB19(B2A:IO_L5N_2) ; also sheet 5
TCK: U2.G15(BNA:TCK) ; also sheet 1,5
TDO0I1: U2.E18(BNA:TDI) ; also sheet 1
TDO1: U2.A19(BNA:TDO) ; also sheet 5
TMS: U2.C18(BNA:TMS) ; also sheet 1,5
VCCINT1: C24.1 C25.1 C26.1 C27.1 C28.1 C29.1 C30.1 C31.1 C32.1 C33.1 C34.1 U2.J8(BVCCINT:VCCINT) U2.J10(BVCCINT:VCCINT) U2.J12(BVCCINT:VCCINT) U2.J14(BVCCINT:VCCINT) U2.K9(BVCCINT:VCCINT) U2.K11(BVCCINT:VCCINT) U2.K13(BVCCINT:VCCINT) U2.L10(BVCCINT:VCCINT) U2.L12(BVCCINT:VCCINT) U2.L14(BVCCINT:VCCINT) U2.M9(BVCCINT:VCCINT) U2.M11(BVCCINT:VCCINT) U2.M13(BVCCINT:VCCINT) U2.N10(BVCCINT:VCCINT) U2.N12(BVCCINT:VCCINT) U2.N14(BVCCINT:VCCINT) U2.P9(BVCCINT:VCCINT) U2.P11(BVCCINT:VCCINT) U2.P13(BVCCINT:VCCINT) U2.R14(BVCCINT:VCCINT) ; supply symbol labelled vccint1 ; also sheet 5
VCCIO: C35.1 C36.1 C37.1 C38.1 C39.1 C40.1 C41.1 C42.1 C43.1 C44.1 C45.1 C46.1 U2.AA3(B2A:VCCO_2) U2.AA7(B2A:VCCO_2) U2.AA11(B2A:VCCO_2) U2.AA15(B2A:VCCO_2) U2.AA19(B2A:VCCO_2) U2.AA22(B2A:IO_L1N_M0_CMPMISO_2) U2.D16(BVCCAUX:VCCAUX) U2.F11(BVCCAUX:VCCAUX) U2.G12(BVCCAUX:VCCAUX) U2.H9(BVCCAUX:VCCAUX) U2.H15(BVCCAUX:VCCAUX) U2.K15(BVCCAUX:VCCAUX) U2.L8(BVCCAUX:VCCAUX) U2.M15(BVCCAUX:VCCAUX) U2.N8(BVCCAUX:VCCAUX) U2.R6(BVCCAUX:VCCAUX) U2.R10(BVCCAUX:VCCAUX) U2.R12(BVCCAUX:VCCAUX) U2.R17(BNA:VBATT) U2.T9(B2A:VCCO_2) U2.T13(B2A:VCCO_2) U2.U11(BVCCAUX:VCCAUX) U2.U15(B2A:IO_L13P_M1_2) U2.V6(BVCCAUX:VCCAUX) U2.V8(B2A:VCCO_2) U2.V12(B2A:VCCO_2) U2.V16(B2A:VCCO_2) U2.W5(B2A:VCCO_2) ; also sheet 1,2,4,5

### Buses
SSEL[0..1]
!PROGRAM[0..1]

### Notes on the sheet
- This is actually VCCAUX,
- but the two nets are merged.
- This is actually VCCAUX,
- but the two nets are merged.
- The connections between FPGA and
- the bus are defined here. Buffer
- capacitors are placed according to
- UG393. The resistor is added for
- debugging purposes. Desolder to debug
- single FPGA. All unused IOs are pulled
- to VCCIO.
- FPGA 1, connections
- 0

## Sheet 4 of 5
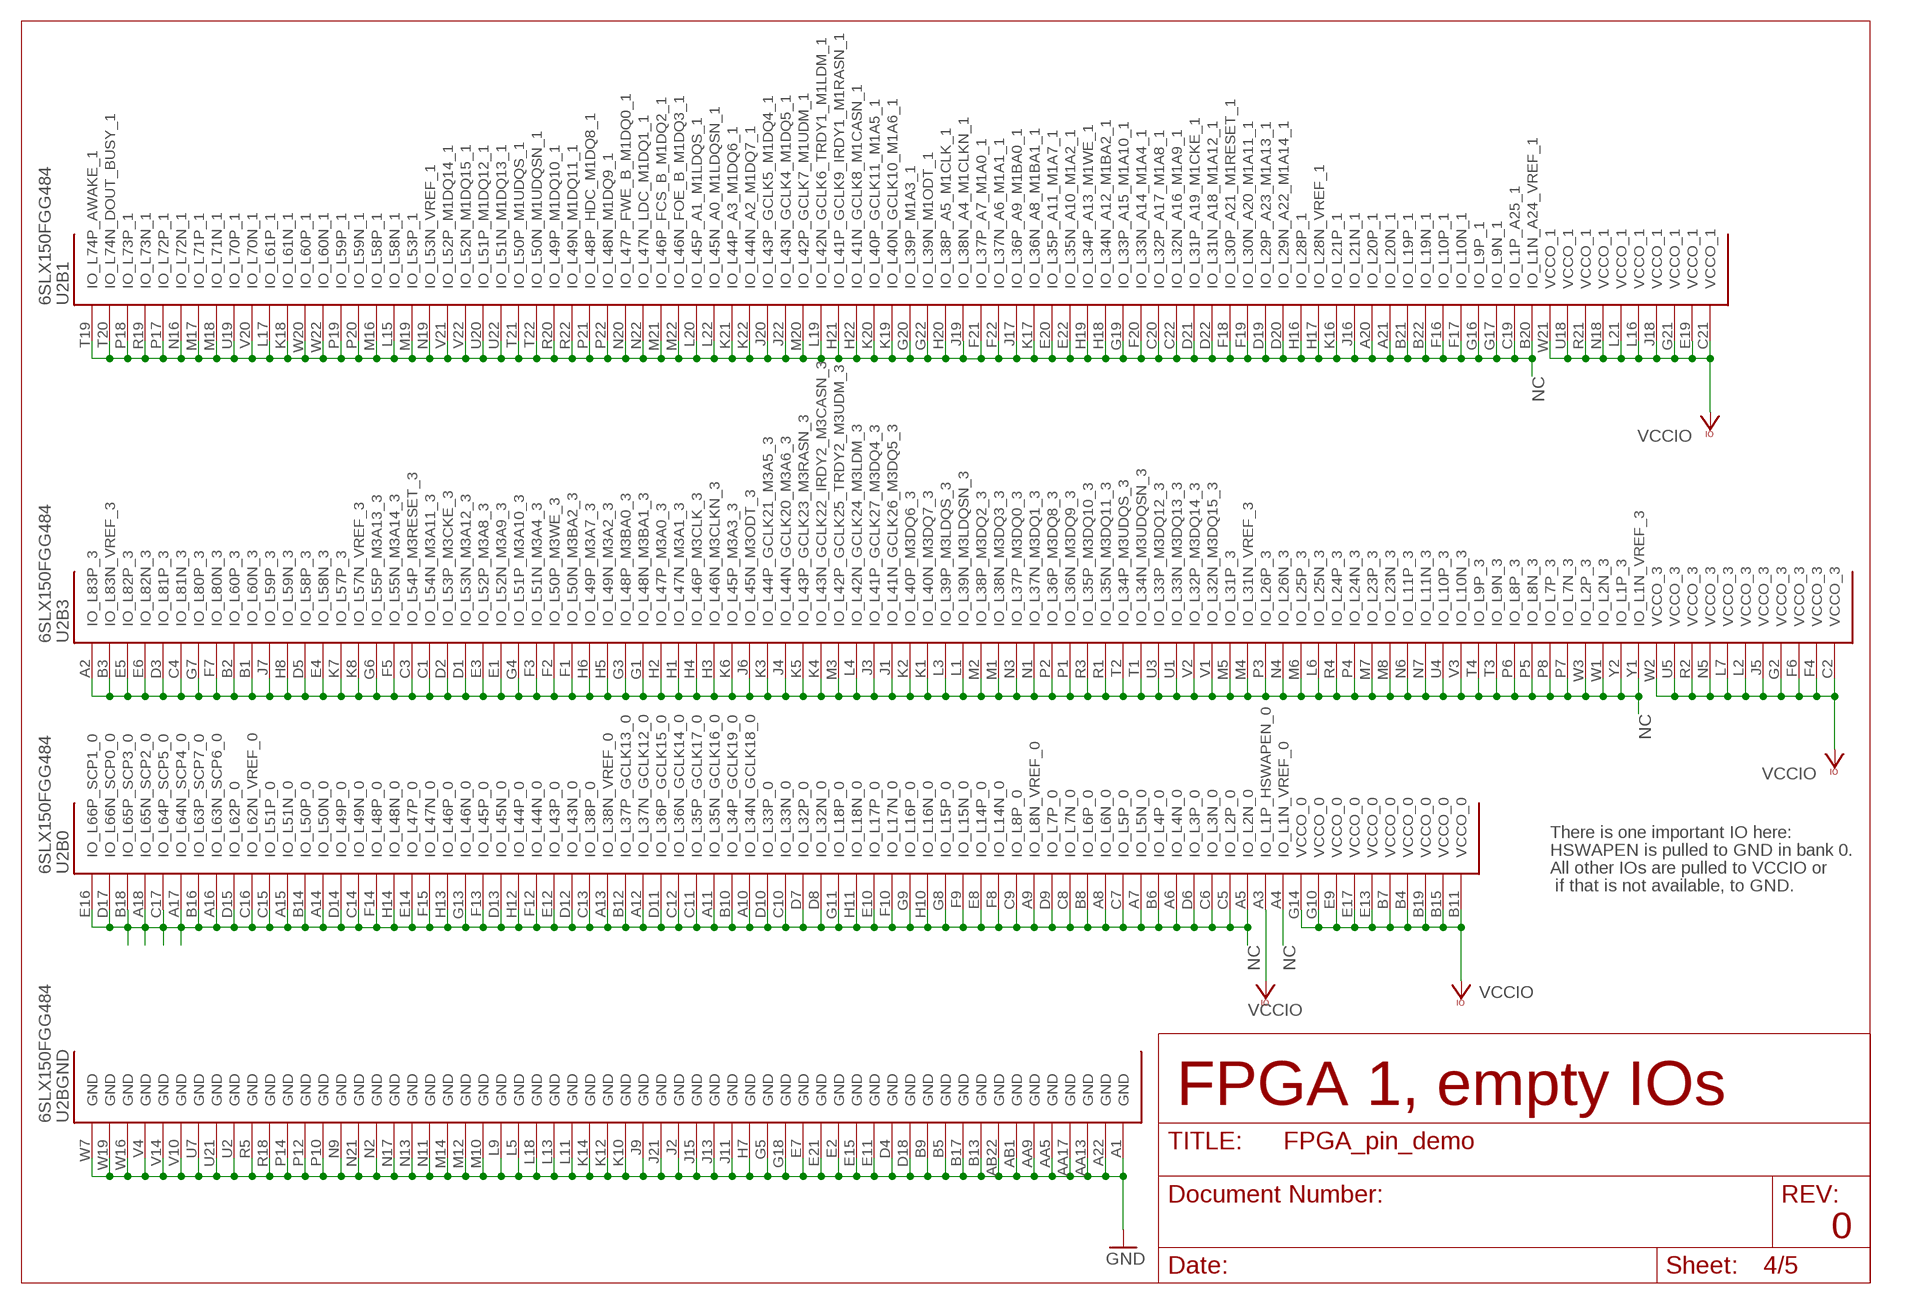
[diagram p3: schematic, sheet 4]

### Nets
GND: U2.A1(BGND:GND) U2.A22(BGND:GND) U2.AA5(BGND:GND) U2.AA9(BGND:GND) U2.AA13(BGND:GND) U2.AA17(BGND:GND) U2.AB1(BGND:GND) U2.AB22(BGND:GND) U2.B5(BGND:GND) U2.B9(BGND:GND) U2.B13(BGND:GND) U2.B17(BGND:GND) U2.D4(BGND:GND) U2.D18(BGND:GND) U2.E2(BGND:GND) U2.E7(BGND:GND) U2.E11(BGND:GND) U2.E15(BGND:GND) U2.E21(BGND:GND) U2.G5(BGND:GND) U2.G18(BGND:GND) U2.H7(BGND:GND) U2.J2(BGND:GND) U2.J9(BGND:GND) U2.J11(BGND:GND) U2.J13(BGND:GND) U2.J15(BGND:GND) U2.J21(BGND:GND) U2.K10(BGND:GND) U2.K12(BGND:GND) U2.K14(BGND:GND) U2.L5(BGND:GND) U2.L9(BGND:GND) U2.L11(BGND:GND) U2.L13(BGND:GND) U2.L18(BGND:GND) U2.M10(BGND:GND) U2.M12(BGND:GND) U2.M14(BGND:GND) U2.N2(BGND:GND) U2.N9(BGND:GND) U2.N11(BGND:GND) U2.N13(BGND:GND) U2.N17(BGND:GND) U2.N21(BGND:GND) U2.P10(BGND:GND) U2.P12(BGND:GND) U2.P14(BGND:GND) U2.R5(BGND:GND) U2.R18(BGND:GND) U2.U2(BGND:GND) U2.U7(BGND:GND) U2.U21(BGND:GND) U2.V4(BGND:GND) U2.V10(BGND:GND) U2.V14(BGND:GND) U2.W7(BGND:GND) U2.W16(BGND:GND) U2.W19(BGND:GND) ; also sheet 1,2,3,5
NC: U2.A2(B3:IO_L83P_3) U2.A4(B0:IO_L1N_VREF_0) U2.A5(B0:IO_L2N_0) U2.A6(B0:IO_L4N_0) U2.A7(B0:IO_L5N_0) U2.A8(B0:IO_L6N_0) U2.A9(B0:IO_L8N_VREF_0) U2.A10(B0:IO_L34N_GCLK18_0) U2.A11(B0:IO_L35N_GCLK16_0) U2.A12(B0:IO_L37N_GCLK12_0) U2.A13(B0:IO_L38N_VREF_0) U2.A14(B0:IO_L50N_0) U2.A15(B0:IO_L51N_0) U2.A16(B0:IO_L63N_SCP6_0) U2.A17(B0:IO_L64N_SCP4_0) U2.A18(B0:IO_L65N_SCP2_0) U2.A20(B1:IO_L20P_1) U2.A21(B1:IO_L20N_1) U2.B1(B3:IO_L60N_3) U2.B2(B3:IO_L60P_3) U2.B3(B3:IO_L83N_VREF_3) U2.B6(B0:IO_L4P_0) U2.B8(B0:IO_L6P_0) U2.B10(B0:IO_L34P_GCLK19_0) U2.B12(B0:IO_L37P_GCLK13_0) U2.B14(B0:IO_L50P_0) U2.B16(B0:IO_L63P_SCP7_0) U2.B18(B0:IO_L65P_SCP3_0) U2.B20(B1:IO_L1N_A24_VREF_1) U2.B21(B1:IO_L19P_1) U2.B22(B1:IO_L19N_1) U2.C1(B3:IO_L54N_M3A11_3) U2.C3(B3:IO_L54P_M3RESET_3) U2.C4(B3:IO_L81N_3) U2.C5(B0:IO_L2P_0) U2.C6(B0:IO_L3N_0) U2.C7(B0:IO_L5P_0) U2.C8(B0:IO_L7N_0) U2.C9(B0:IO_L8P_0) U2.C10(B0:IO_L33N_0) U2.C11(B0:IO_L35P_GCLK17_0) U2.C12(B0:IO_L36N_GCLK14_0) U2.C13(B0:IO_L38P_0) U2.C14(B0:IO_L49N_0) U2.C15(B0:IO_L51P_0) U2.C16(B0:IO_L62N_VREF_0) U2.C17(B0:IO_L64P_SCP5_0) U2.C19(B1:IO_L1P_A25_1) U2.C20(B1:IO_L32P_A17_M1A8_1) U2.C22(B1:IO_L32N_A16_M1A9_1) U2.D1(B3:IO_L53N_M3A12_3) U2.D2(B3:IO_L53P_M3CKE_3) U2.D3(B3:IO_L81P_3) U2.D5(B3:IO_L58P_3) U2.D6(B0:IO_L3P_0) U2.D7(B0:IO_L32P_0) U2.D8(B0:IO_L32N_0) U2.D9(B0:IO_L7P_0) U2.D10(B0:IO_L33P_0) U2.D11(B0:IO_L36P_GCLK15_0) U2.D12(B0:IO_L43N_0) U2.D13(B0:IO_L45N_0) U2.D14(B0:IO_L49P_0) U2.D15(B0:IO_L62P_0) U2.D17(B0:IO_L66N_SCP0_0) U2.D19(B1:IO_L29P_A23_M1A13_1) U2.D20(B1:IO_L29N_A22_M1A14_1) U2.D21(B1:IO_L31P_A19_M1CKE_1) U2.D22(B1:IO_L31N_A18_M1A12_1) U2.E1(B3:IO_L52N_M3A9_3) U2.E3(B3:IO_L52P_M3A8_3) U2.E4(B3:IO_L58N_3) U2.E5(B3:IO_L82P_3) U2.E6(B3:IO_L82N_3) U2.E8(B0:IO_L14P_0) U2.E10(B0:IO_L17P_0) U2.E12(B0:IO_L43P_0) U2.E14(B0:IO_L47P_0) U2.E16(B0:IO_L66P_SCP1_0) U2.E20(B1:IO_L35P_A11_M1A7_1) U2.E22(B1:IO_L35N_A10_M1A2_1) U2.F1(B3:IO_L50N_M3BA2_3) U2.F2(B3:IO_L50P_M3WE_3) U2.F3(B3:IO_L51N_M3A4_3) U2.F5(B3:IO_L55N_M3A14_3) U2.F7(B3:IO_L80N_3) U2.F8(B0:IO_L14N_0) U2.F9(B0:IO_L15N_0) U2.F10(B0:IO_L17N_0) U2.F12(B0:IO_L44N_0) U2.F13(B0:IO_L45P_0) U2.F14(B0:IO_L48P_0) U2.F15(B0:IO_L47N_0) U2.F16(B1:IO_L10P_1) U2.F17(B1:IO_L10N_1) U2.F18(B1:IO_L30P_A21_M1RESET_1) U2.F19(B1:IO_L30N_A20_M1A11_1) U2.F20(B1:IO_L33N_A14_M1A4_1) U2.F21(B1:IO_L37P_A7_M1A0_1) U2.F22(B1:IO_L37N_A6_M1A1_1) U2.G1(B3:IO_L48N_M3BA1_3) U2.G3(B3:IO_L48P_M3BA0_3) U2.G4(B3:IO_L51P_M3A10_3) U2.G6(B3:IO_L55P_M3A13_3) U2.G7(B3:IO_L80P_3) U2.G8(B0:IO_L15P_0) U2.G9(B0:IO_L16P_0) U2.G11(B0:IO_L18P_0) U2.G13(B0:IO_L46N_0) U2.G16(B1:IO_L9P_1) U2.G17(B1:IO_L9N_1) U2.G19(B1:IO_L33P_A15_M1A10_1) U2.G20(B1:IO_L39P_M1A3_1) U2.G22(B1:IO_L39N_M1ODT_1) U2.H1(B3:IO_L47N_M3A1_3) U2.H2(B3:IO_L47P_M3A0_3) U2.H3(B3:IO_L46N_M3CLKN_3) U2.H4(B3:IO_L46P_M3CLK_3) U2.H5(B3:IO_L49N_M3A2_3) U2.H6(B3:IO_L49P_M3A7_3) U2.H8(B3:IO_L59N_3) U2.H10(B0:IO_L16N_0) U2.H11(B0:IO_L18N_0) U2.H12(B0:IO_L44P_0) U2.H13(B0:IO_L46P_0) U2.H14(B0:IO_L48N_0) U2.H16(B1:IO_L28P_1) U2.H17(B1:IO_L28N_VREF_1) U2.H18(B1:IO_L34N_A12_M1BA2_1) U2.H19(B1:IO_L34P_A13_M1WE_1) U2.H20(B1:IO_L38P_A5_M1CLK_1) U2.H21(B1:IO_L41P_GCLK9_IRDY1_M1RASN_1) U2.H22(B1:IO_L41N_GCLK8_M1CASN_1) U2.J1(B3:IO_L41N_GCLK26_M3DQ5_3) U2.J3(B3:IO_L41P_GCLK27_M3DQ4_3) U2.J4(B3:IO_L44N_GCLK20_M3A6_3) U2.J6(B3:IO_L45N_M3ODT_3) U2.J7(B3:IO_L59P_3) U2.J16(B1:IO_L21N_1) U2.J17(B1:IO_L36P_A9_M1BA0_1) U2.J19(B1:IO_L38N_A4_M1CLKN_1) U2.J20(B1:IO_L43P_GCLK5_M1DQ4_1) U2.J22(B1:IO_L43N_GCLK4_M1DQ5_1) U2.K1(B3:IO_L40N_M3DQ7_3) U2.K2(B3:IO_L40P_M3DQ6_3) U2.K3(B3:IO_L44P_GCLK21_M3A5_3) U2.K4(B3:IO_L43N_GCLK22_IRDY2_M3CASN_3) U2.K5(B3:IO_L43P_GCLK23_M3RASN_3) U2.K6(B3:IO_L45P_M3A3_3) U2.K7(B3:IO_L57P_3) U2.K8(B3:IO_L57N_VREF_3) U2.K16(B1:IO_L21P_1) U2.K17(B1:IO_L36N_A8_M1BA1_1) U2.K18(B1:IO_L61N_1) U2.K19(B1:IO_L40N_GCLK10_M1A6_1) U2.K20(B1:IO_L40P_GCLK11_M1A5_1) U2.K21(B1:IO_L44P_A3_M1DQ6_1) U2.K22(B1:IO_L44N_A2_M1DQ7_1) U2.L1(B3:IO_L39N_M3LDQSN_3) U2.L3(B3:IO_L39P_M3LDQS_3) U2.L4(B3:IO_L42N_GCLK24_M3LDM_3) U2.L6(B3:IO_L25N_3) U2.L15(B1:IO_L58N_1) U2.L17(B1:IO_L61P_1) U2.L19(B1:IO_L42N_GCLK6_TRDY1_M1LDM_1) U2.L20(B1:IO_L45P_A1_M1LDQS_1) U2.L22(B1:IO_L45N_A0_M1LDQSN_1) U2.M1(B3:IO_L38N_M3DQ3_3) U2.M2(B3:IO_L38P_M3DQ2_3) U2.M3(B3:IO_L42P_GCLK25_TRDY2_M3UDM_3) U2.M4(B3:IO_L31N_VREF_3) U2.M5(B3:IO_L31P_3) U2.M6(B3:IO_L25P_3) U2.M7(B3:IO_L23P_3) U2.M8(B3:IO_L23N_3) U2.M16(B1:IO_L58P_1) U2.M17(B1:IO_L71P_1) U2.M18(B1:IO_L71N_1) U2.M19(B1:IO_L53P_1) U2.M20(B1:IO_L42P_GCLK7_M1UDM_1) U2.M21(B1:IO_L46P_FCS_B_M1DQ2_1) U2.M22(B1:IO_L46N_FOE_B_M1DQ3_1) U2.N1(B3:IO_L37N_M3DQ1_3) U2.N3(B3:IO_L37P_M3DQ0_3) U2.N4(B3:IO_L26N_3) U2.N6(B3:IO_L11P_3) U2.N7(B3:IO_L11N_3) U2.N16(B1:IO_L72N_1) U2.N19(B1:IO_L53N_VREF_1) U2.N20(B1:IO_L47P_FWE_B_M1DQ0_1) U2.N22(B1:IO_L47N_LDC_M1DQ1_1) U2.P1(B3:IO_L36N_M3DQ9_3) U2.P2(B3:IO_L36P_M3DQ8_3) U2.P3(B3:IO_L26P_3) U2.P4(B3:IO_L24N_3) U2.P5(B3:IO_L8N_3) U2.P6(B3:IO_L8P_3) U2.P7(B3:IO_L7N_3) U2.P8(B3:IO_L7P_3) U2.P17(B1:IO_L72P_1) U2.P18(B1:IO_L73P_1) U2.P19(B1:IO_L59P_1) U2.P20(B1:IO_L59N_1) U2.P21(B1:IO_L48P_HDC_M1DQ8_1) U2.P22(B1:IO_L48N_M1DQ9_1) U2.R1(B3:IO_L35N_M3DQ11_3) U2.R3(B3:IO_L35P_M3DQ10_3) U2.R4(B3:IO_L24P_3) U2.R19(B1:IO_L73N_1) U2.R20(B1:IO_L49P_M1DQ10_1) U2.R22(B1:IO_L49N_M1DQ11_1) U2.T1(B3:IO_L34N_M3UDQSN_3) U2.T2(B3:IO_L34P_M3UDQS_3) U2.T3(B3:IO_L9N_3) U2.T4(B3:IO_L9P_3) U2.T19(B1:IO_L74P_AWAKE_1) U2.T20(B1:IO_L74N_DOUT_BUSY_1) U2.T21(B1:IO_L50P_M1UDQS_1) U2.T22(B1:IO_L50N_M1UDQSN_1) U2.U1(B3:IO_L33N_M3DQ13_3) U2.U3(B3:IO_L33P_M3DQ12_3) U2.U4(B3:IO_L10P_3) U2.U19(B1:IO_L70P_1) U2.U20(B1:IO_L51P_M1DQ12_1) U2.U22(B1:IO_L51N_M1DQ13_1) U2.V1(B3:IO_L32N_M3DQ15_3) U2.V2(B3:IO_L32P_M3DQ14_3) U2.V3(B3:IO_L10N_3) U2.V20(B1:IO_L70N_1) U2.V21(B1:IO_L52P_M1DQ14_1) U2.V22(B1:IO_L52N_M1DQ15_1) U2.W1(B3:IO_L2N_3) U2.W3(B3:IO_L2P_3) U2.W20(B1:IO_L60P_1) U2.W22(B1:IO_L60N_1) U2.Y1(B3:IO_L1N_VREF_3) U2.Y2(B3:IO_L1P_3) ; also sheet 1,2,3,5
VCCIO: U2.A3(B0:IO_L1P_HSWAPEN_0) U2.B4(B0:VCCO_0) U2.B7(B0:VCCO_0) U2.B11(B0:VCCO_0) U2.B15(B0:VCCO_0) U2.B19(B0:VCCO_0) U2.C2(B3:VCCO_3) U2.C21(B1:VCCO_1) U2.E9(B0:VCCO_0) U2.E13(B0:VCCO_0) U2.E17(B0:VCCO_0) U2.E19(B1:VCCO_1) U2.F4(B3:VCCO_3) U2.F6(B3:VCCO_3) U2.G2(B3:VCCO_3) U2.G10(B0:VCCO_0) U2.G14(B0:VCCO_0) U2.G21(B1:VCCO_1) U2.J5(B3:VCCO_3) U2.J18(B1:VCCO_1) U2.L2(B3:VCCO_3) U2.L7(B3:VCCO_3) U2.L16(B1:VCCO_1) U2.L21(B1:VCCO_1) U2.N5(B3:VCCO_3) U2.N18(B1:VCCO_1) U2.R2(B3:VCCO_3) U2.R21(B1:VCCO_1) U2.U5(B3:VCCO_3) U2.U18(B1:VCCO_1) U2.W2(B3:VCCO_3) U2.W21(B1:VCCO_1) ; also sheet 1,2,3,5

### Notes on the sheet
- There is one important IO here:
- HSWAPEN is pulled to GND in bank 0.
- All other IOs are pulled to VCCIO or
- if that is not available, to GND.
- FPGA 1, empty IOs
- 0

## Sheet 5 of 5
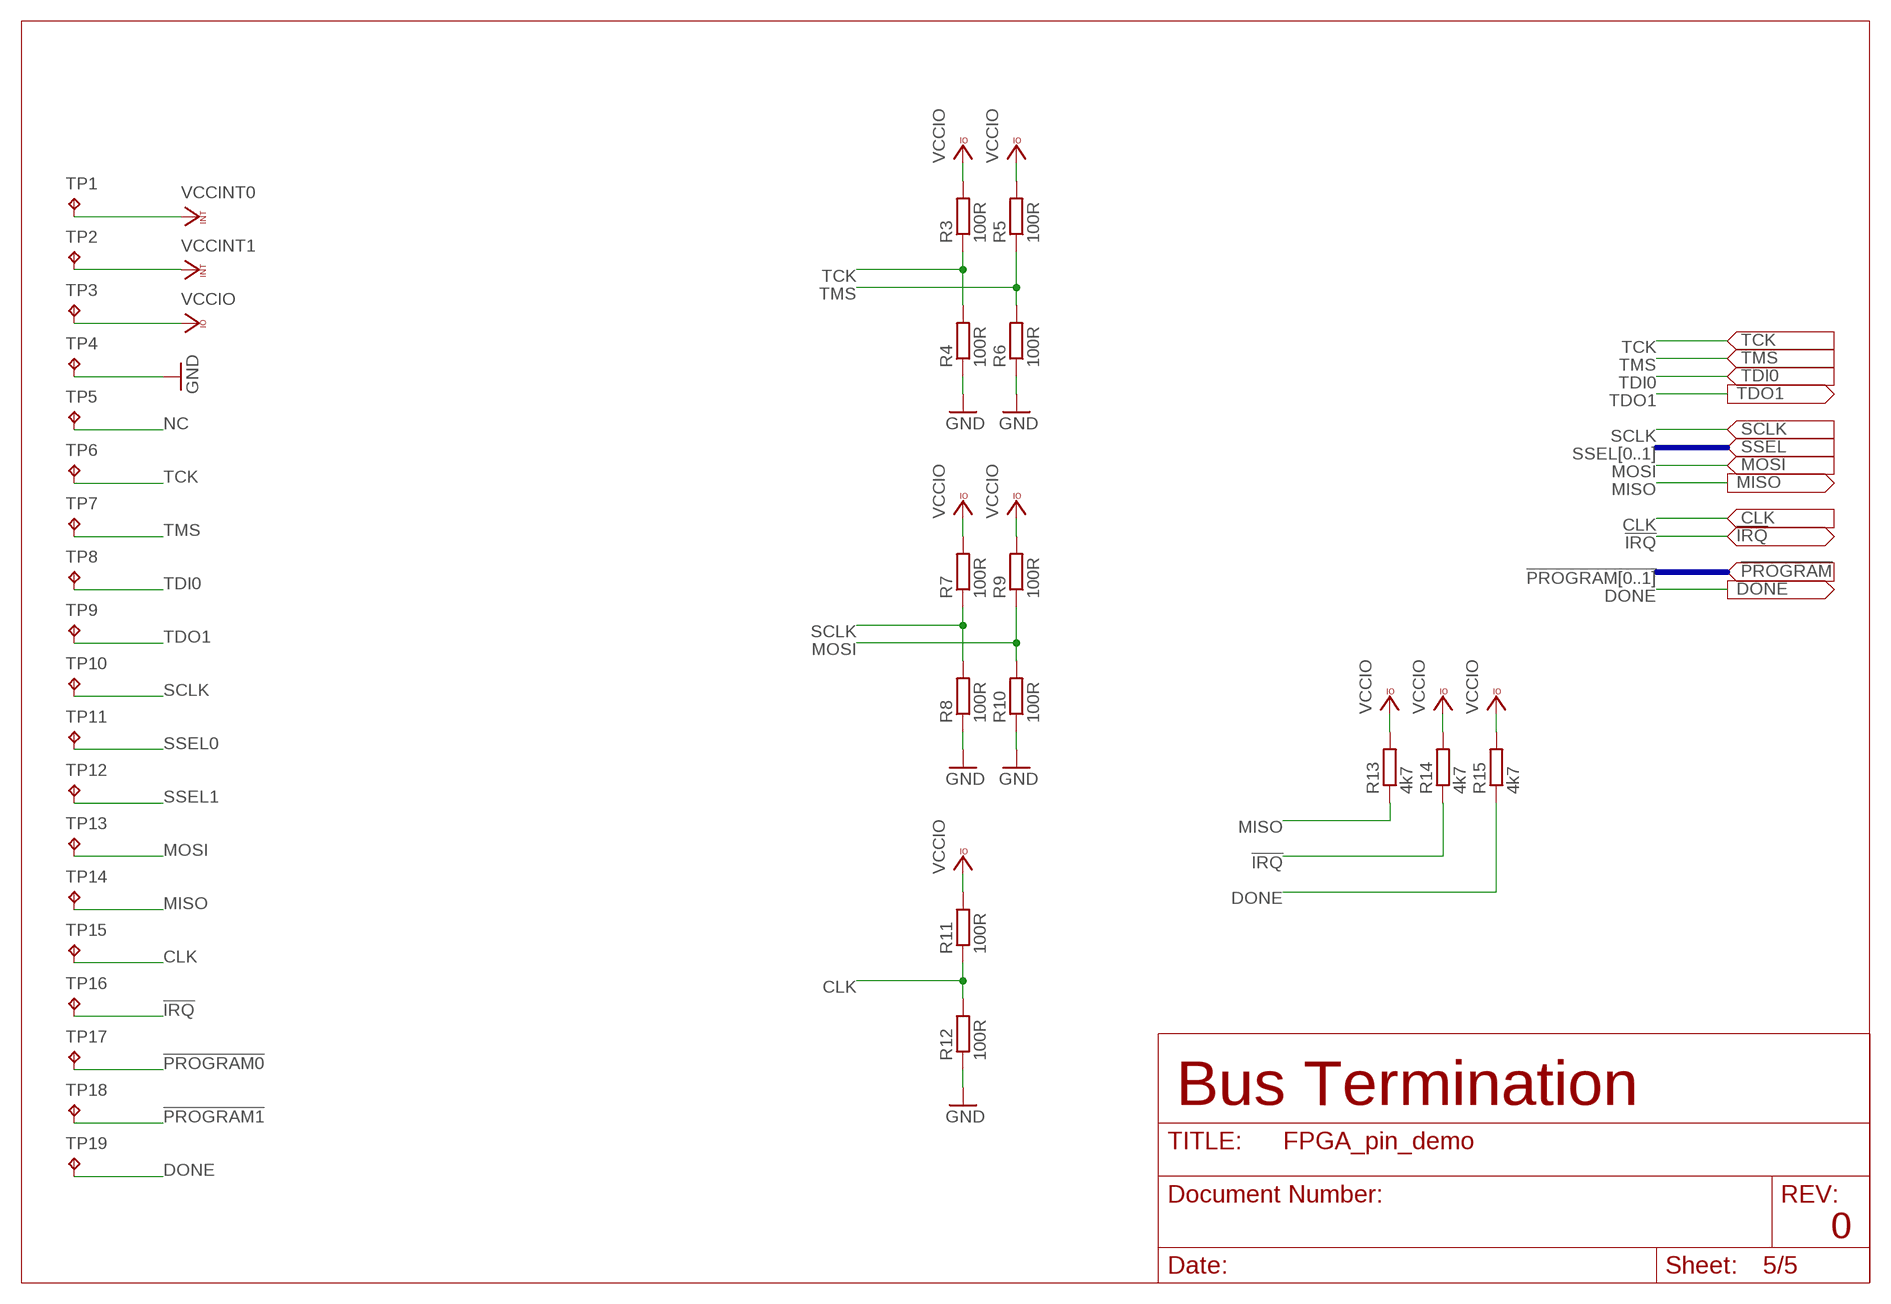
[diagram p4: schematic, sheet 5]

### Parts
R3  100R  R-EU_R2012  [R2012]
R4  100R  R-EU_R2012  [R2012]
R5  100R  R-EU_R2012  [R2012]
R6  100R  R-EU_R2012  [R2012]
R7  100R  R-EU_R2012  [R2012]
R8  100R  R-EU_R2012  [R2012]
R9  100R  R-EU_R2012  [R2012]
R10  100R  R-EU_R2012  [R2012]
R11  100R  R-EU_R2012  [R2012]
R12  100R  R-EU_R2012  [R2012]
R13  4k7  R-EU_R2012  [R2012]
R14  4k7  R-EU_R2012  [R2012]
R15  4k7  R-EU_R2012  [R2012]
TP1  TPPAD1-13  [P1-13]
TP2  TPPAD1-13  [P1-13]
TP3  TPPAD1-13  [P1-13]
TP4  TPPAD1-13  [P1-13]
TP5  TPPAD1-13  [P1-13]
TP6  TPPAD1-13  [P1-13]
TP7  TPPAD1-13  [P1-13]
TP8  TPPAD1-13  [P1-13]
TP9  TPPAD1-13  [P1-13]
TP10  TPPAD1-13  [P1-13]
TP11  TPPAD1-13  [P1-13]
TP12  TPPAD1-13  [P1-13]
TP13  TPPAD1-13  [P1-13]
TP14  TPPAD1-13  [P1-13]
TP15  TPPAD1-13  [P1-13]
TP16  TPPAD1-13  [P1-13]
TP17  TPPAD1-13  [P1-13]
TP18  TPPAD1-13  [P1-13]
TP19  TPPAD1-13  [P1-13]

### Nets
!IRQ: R14.1 TP16.TP ; also sheet 1,3
!PROGRAM0: TP17.TP ; also sheet 1
!PROGRAM1: TP18.TP ; also sheet 3
CLK: R11.1 R12.2 TP15.TP ; also sheet 1,3
DONE: R15.1 TP19.TP ; also sheet 1,3
GND: R4.1 R6.1 R8.1 R10.1 R12.1 TP4.TP ; also sheet 1,2,3,4
MISO: R13.1 TP14.TP ; also sheet 1,3
MOSI: R9.1 R10.2 TP13.TP ; also sheet 1,3
NC: TP5.TP ; also sheet 1,2,3,4
SCLK: R7.1 R8.2 TP10.TP ; also sheet 1,3
SSEL0: TP11.TP ; also sheet 1
SSEL1: TP12.TP ; also sheet 3
TCK: R3.1 R4.2 TP6.TP ; also sheet 1,3
TDI0: TP8.TP ; also sheet 1
TDO1: TP9.TP ; also sheet 3
TMS: R5.1 R6.2 TP7.TP ; also sheet 1,3
VCCINT0: TP1.TP ; also sheet 1
VCCINT1: TP2.TP ; also sheet 3
VCCIO: R3.2 R5.2 R7.2 R9.2 R11.2 R13.2 R14.2 R15.2 TP3.TP ; also sheet 1,2,3,4

### Buses
SSEL[0..1]
!PROGRAM[0..1]

### Notes on the sheet
- Bus Termination
- 0

## Library data of the parts
C1-C46 = rcl:C-EU: CAPACITOR, European symbol
R1-R15 = rcl:R-EU_: RESISTOR, European symbol
TP1-TP19 = testpad:TP: Test pad
U1 U2 = FPGAcomp:6SLX150FGG484: Xilinx FPGA: 6SLX150FGG484